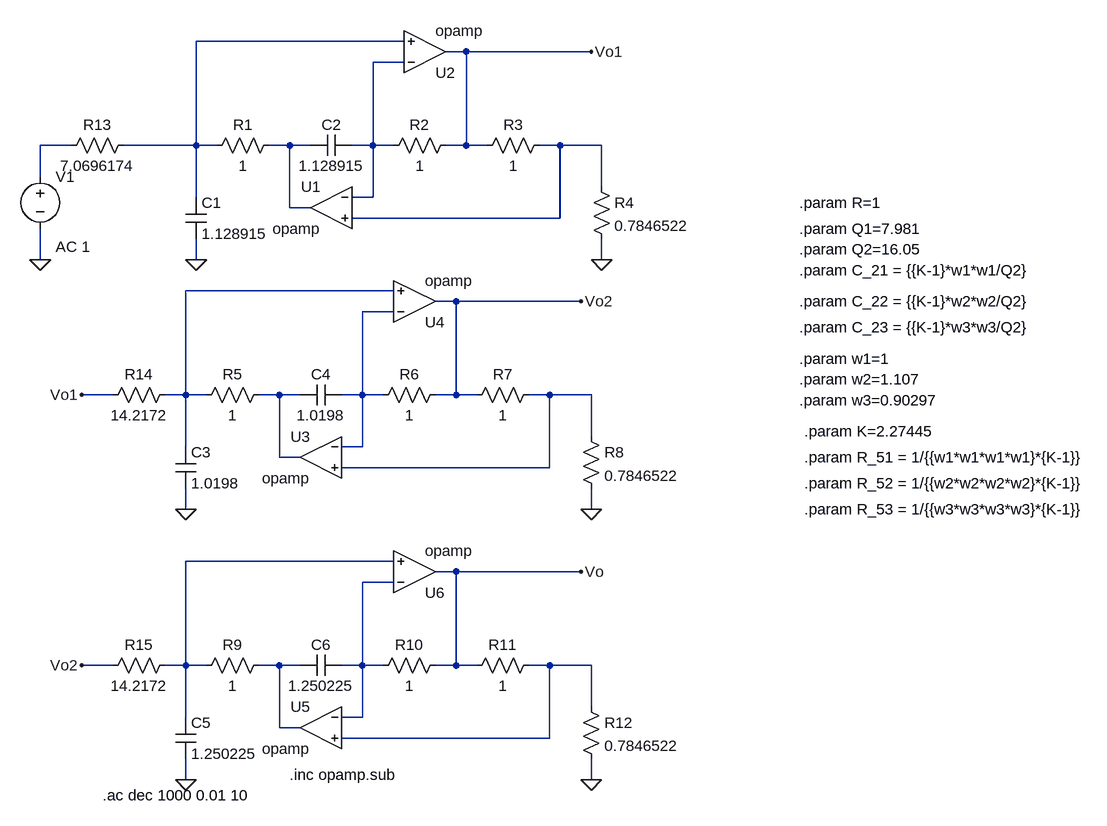
[diagram p0: schematic Circutio_param.asc]
Circutio_param.asc, the LTspice schematic file:
Version 4
SHEET 1 1584 1128
WIRE 432 -48 112 -48
WIRE 528 -32 496 -32
WIRE 720 -32 528 -32
WIRE 432 -16 384 -16
WIRE -80 112 -128 112
WIRE 112 112 112 -48
WIRE 112 112 0 112
WIRE 144 112 112 112
WIRE 256 112 224 112
WIRE 288 112 256 112
WIRE 384 112 384 -16
WIRE 384 112 352 112
WIRE 416 112 384 112
WIRE 528 112 528 -32
WIRE 528 112 496 112
WIRE 560 112 528 112
WIRE 672 112 640 112
WIRE 736 112 672 112
WIRE -128 160 -128 112
WIRE 736 176 736 112
WIRE 112 192 112 112
WIRE 384 192 384 112
WIRE 384 192 352 192
WIRE 256 208 256 112
WIRE 288 208 256 208
WIRE 672 224 672 112
WIRE 672 224 352 224
WIRE -128 288 -128 240
WIRE 112 288 112 256
WIRE 736 288 736 256
WIRE 416 336 96 336
WIRE 512 352 480 352
WIRE 704 352 512 352
WIRE 416 368 368 368
WIRE -16 496 -64 496
WIRE 96 496 96 336
WIRE 96 496 64 496
WIRE 128 496 96 496
WIRE 240 496 208 496
WIRE 272 496 240 496
WIRE 368 496 368 368
WIRE 368 496 336 496
WIRE 400 496 368 496
WIRE 512 496 512 352
WIRE 512 496 480 496
WIRE 544 496 512 496
WIRE 656 496 624 496
WIRE 720 496 656 496
WIRE 720 560 720 496
WIRE 96 576 96 496
WIRE 368 576 368 496
WIRE 368 576 336 576
WIRE 240 592 240 496
WIRE 272 592 240 592
WIRE 656 608 656 496
WIRE 656 608 336 608
WIRE 96 672 96 640
WIRE 720 672 720 640
WIRE 416 752 96 752
WIRE 512 768 480 768
WIRE 704 768 512 768
WIRE 416 784 368 784
WIRE -16 912 -64 912
WIRE 96 912 96 752
WIRE 96 912 64 912
WIRE 128 912 96 912
WIRE 240 912 208 912
WIRE 272 912 240 912
WIRE 368 912 368 784
WIRE 368 912 336 912
WIRE 400 912 368 912
WIRE 512 912 512 768
WIRE 512 912 480 912
WIRE 544 912 512 912
WIRE 656 912 624 912
WIRE 720 912 656 912
WIRE 720 976 720 912
WIRE 96 992 96 912
WIRE 368 992 368 912
WIRE 368 992 336 992
WIRE 240 1008 240 912
WIRE 272 1008 240 1008
WIRE 656 1024 656 912
WIRE 656 1024 336 1024
WIRE 96 1088 96 1056
WIRE 720 1088 720 1056
FLAG 112 288 0
FLAG 736 288 0
FLAG 720 -32 Vo1
FLAG 96 672 0
FLAG 720 672 0
FLAG -64 496 Vo1
FLAG 96 1088 0
FLAG 720 1088 0
FLAG 704 352 Vo2
FLAG -64 912 Vo2
FLAG 704 768 Vo
FLAG -128 288 0
SYMBOL cap 96 192 R0
SYMATTR InstName C1
SYMATTR Value 1.128915
SYMBOL res 240 96 R90
WINDOW 0 0 56 VBottom 2
WINDOW 3 32 56 VTop 2
SYMATTR InstName R1
SYMATTR Value 1
SYMBOL OpAmps\\opamp 320 144 M0
SYMATTR InstName U1
SYMBOL cap 352 96 R90
WINDOW 0 0 32 VBottom 2
WINDOW 3 32 32 VTop 2
SYMATTR InstName C2
SYMATTR Value 1.128915
SYMBOL res 512 96 R90
WINDOW 0 0 56 VBottom 2
WINDOW 3 32 56 VTop 2
SYMATTR InstName R2
SYMATTR Value 1
SYMBOL res 656 96 R90
WINDOW 0 0 56 VBottom 2
WINDOW 3 32 56 VTop 2
SYMATTR InstName R3
SYMATTR Value 1
SYMBOL res 720 160 R0
SYMATTR InstName R4
SYMATTR Value 0.7846522
SYMBOL OpAmps\\opamp 464 32 M180
SYMATTR InstName U2
SYMBOL cap 80 576 R0
SYMATTR InstName C3
SYMATTR Value 1.0198
SYMBOL res 224 480 R90
WINDOW 0 0 56 VBottom 2
WINDOW 3 32 56 VTop 2
SYMATTR InstName R5
SYMATTR Value 1
SYMBOL OpAmps\\opamp 304 528 M0
SYMATTR InstName U3
SYMBOL cap 336 480 R90
WINDOW 0 0 32 VBottom 2
WINDOW 3 32 32 VTop 2
SYMATTR InstName C4
SYMATTR Value 1.0198
SYMBOL res 496 480 R90
WINDOW 0 0 56 VBottom 2
WINDOW 3 32 56 VTop 2
SYMATTR InstName R6
SYMATTR Value 1
SYMBOL res 640 480 R90
WINDOW 0 0 56 VBottom 2
WINDOW 3 32 56 VTop 2
SYMATTR InstName R7
SYMATTR Value 1
SYMBOL res 704 544 R0
SYMATTR InstName R8
SYMATTR Value 0.7846522
SYMBOL OpAmps\\opamp 448 416 M180
SYMATTR InstName U4
SYMBOL cap 80 992 R0
SYMATTR InstName C5
SYMATTR Value 1.250225
SYMBOL res 224 896 R90
WINDOW 0 0 56 VBottom 2
WINDOW 3 32 56 VTop 2
SYMATTR InstName R9
SYMATTR Value 1
SYMBOL OpAmps\\opamp 304 944 M0
SYMATTR InstName U5
SYMBOL cap 336 896 R90
WINDOW 0 0 32 VBottom 2
WINDOW 3 32 32 VTop 2
SYMATTR InstName C6
SYMATTR Value 1.250225
SYMBOL res 496 896 R90
WINDOW 0 0 56 VBottom 2
WINDOW 3 32 56 VTop 2
SYMATTR InstName R10
SYMATTR Value 1
SYMBOL res 640 896 R90
WINDOW 0 0 56 VBottom 2
WINDOW 3 32 56 VTop 2
SYMATTR InstName R11
SYMATTR Value 1
SYMBOL res 704 960 R0
SYMATTR InstName R12
SYMATTR Value 0.7846522
SYMBOL OpAmps\\opamp 448 832 M180
SYMATTR InstName U6
SYMBOL voltage -128 144 R0
WINDOW 123 24 124 Left 2
WINDOW 39 0 0 Left 0
SYMATTR Value2 AC 1
SYMATTR InstName V1
SYMATTR Value ""
SYMBOL res 16 96 R90
WINDOW 0 0 56 VBottom 2
WINDOW 3 32 56 VTop 2
SYMATTR InstName R13
SYMATTR Value 7.0696174
SYMBOL res 80 480 R90
WINDOW 0 0 56 VBottom 2
WINDOW 3 32 56 VTop 2
SYMATTR InstName R14
SYMATTR Value 14.2172
SYMBOL res 80 896 R90
WINDOW 0 0 56 VBottom 2
WINDOW 3 32 56 VTop 2
SYMATTR InstName R15
SYMATTR Value 14.2172
TEXT 1040 200 Left 2 !.param R=1
TEXT 1040 240 Left 2 !.param Q1=7.981
TEXT 1040 272 Left 2 !.param Q2=16.05
TEXT 1040 304 Left 2 !.param C_21 = {{K-1}*w1*w1/Q2}
TEXT 1040 352 Left 2 !.param C_22 = {{K-1}*w2*w2/Q2}
TEXT 1040 392 Left 2 !.param C_23 = {{K-1}*w3*w3/Q2}
TEXT 1040 440 Left 2 !.param w1=1
TEXT 1040 472 Left 2 !.param w2=1.107
TEXT 1040 504 Left 2 !.param w3=0.90297
TEXT 1048 552 Left 2 !.param K=2.27445
TEXT 1048 592 Left 2 !.param R_51 = 1/{{w1*w1*w1*w1}*{K-1}}
TEXT 1048 632 Left 2 !.param R_52 = 1/{{w2*w2*w2*w2}*{K-1}}
TEXT 1048 672 Left 2 !.param R_53 = 1/{{w3*w3*w3*w3}*{K-1}}
TEXT 256 1080 Left 2 !.inc opamp.sub
TEXT -32 1112 Left 2 !.ac dec 1000 0.01 10

The netlist it stands for:
* Circutio_param.asc
C1 N001 0 1.128915
R1 N004 N001 1
XU1 N002 N005 N004 opamp Aol=100K GBW=10Meg  ; pins invin noninvin out
C2 N002 N004 1.128915
R2 Vo1 N002 1
R3 N005 Vo1 1
R4 N005 0 0.7846522
XU2 N002 N001 Vo1 opamp Aol=100K GBW=10Meg  ; pins invin noninvin out
C3 N006 0 1.0198
R5 N008 N006 1
XU3 N007 N009 N008 opamp Aol=100K GBW=10Meg  ; pins invin noninvin out
C4 N007 N008 1.0198
R6 Vo2 N007 1
R7 N009 Vo2 1
R8 N009 0 0.7846522
XU4 N007 N006 Vo2 opamp Aol=100K GBW=10Meg  ; pins invin noninvin out
C5 N010 0 1.250225
R9 N012 N010 1
XU5 N011 N013 N012 opamp Aol=100K GBW=10Meg  ; pins invin noninvin out
C6 N011 N012 1.250225
R10 Vo N011 1
R11 N013 Vo 1
R12 N013 0 0.7846522
XU6 N011 N010 Vo opamp Aol=100K GBW=10Meg  ; pins invin noninvin out
V1 N003 0 AC 1
R13 N001 N003 7.0696174
R14 N006 Vo1 14.2172
R15 N010 Vo2 14.2172
.param R=1
.param Q1=7.981
.param Q2=16.05
.param C_21 = {{K-1}*w1*w1/Q2}
.param C_22 = {{K-1}*w2*w2/Q2}
.param C_23 = {{K-1}*w3*w3/Q2}
.param w1=1
.param w2=1.107
.param w3=0.90297
.param K=2.27445
.param R_51 = 1/{{w1*w1*w1*w1}*{K-1}}
.param R_52 = 1/{{w2*w2*w2*w2}*{K-1}}
.param R_53 = 1/{{w3*w3*w3*w3}*{K-1}}
.inc opamp.sub
.ac dec 1000 0.01 10
.backanno
.end

* Results of the author's LTspice run, read from the files saved beside the schematic
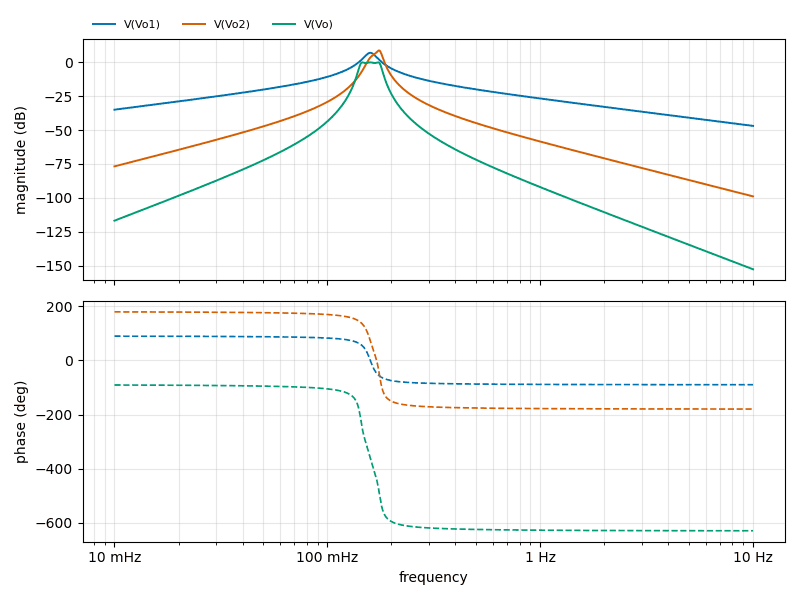
[diagram p1: AC Analysis of Circutio_param.asc, plotted from the saved traces]
* AC Analysis, 1 run:
*   V(Vo1): -34.91 dB at 10 mHz, -46.87 dB at 10 Hz, peak 7.13 dB at 159.2 mHz, 3 dB below the peak at 149.5 mHz and 169.4 mHz
*   V(Vo2): -76.77 dB at 10 mHz, -98.92 dB at 10 Hz, peak 8.88 dB at 175 mHz, 3 dB below the peak at 165.7 mHz and 179.8 mHz
*   V(Vo): -116.85 dB at 10 mHz, -152.74 dB at 10 Hz, peak 0.03 dB at 173.4 mHz, 3 dB below the peak at 141.7 mHz and 178.7 mHz